# EAGLE schematic BSPD Schematic (EAGLE 8.4.0)
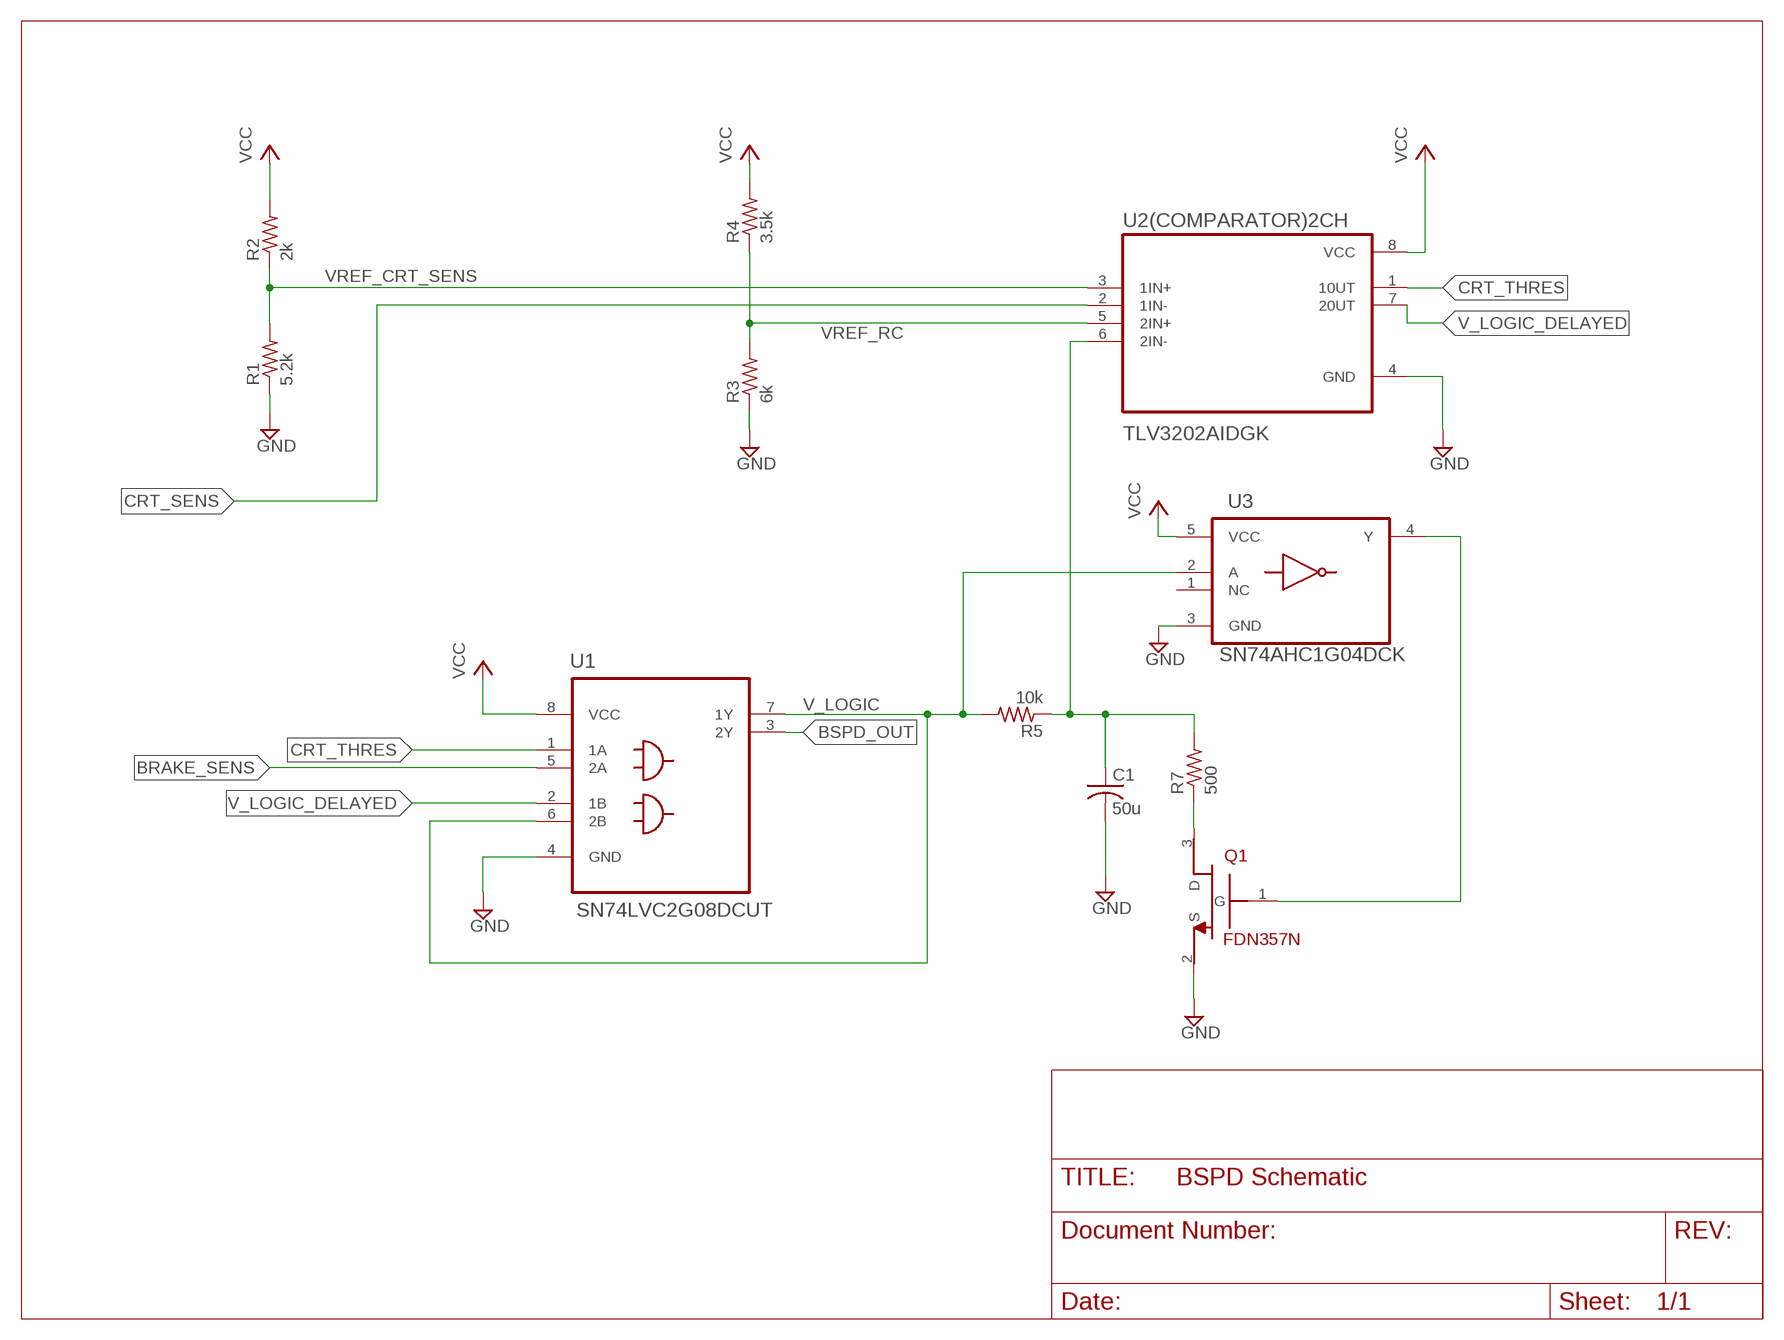
[diagram p0: schematic, sheet 1]

## Parts
C1  50u  C-USC0603  [C0603]
Q1  FDN357N  [SOT95P280X130-3N]
R1  5.2k  R-US_R0603  [R0603]
R2  2k  R-US_R0603  [R0603]
R3  6k  R-US_R0603  [R0603]
R4  3.5k  R-US_R0603  [R0603]
R5  10k  R-US_R0603  [R0603]
R7  500  R-US_R0603  [R0603]
U1  SN74LVC2G08DCUT  [SOP50P310X90-8N]
U2(COMPARATOR)2CH  TLV3202AIDGK  [SOP65P490X110-9N]
U3  SN74AHC1G04DCK  [SOT65P210X110-5N]

## Nets
BRAKE_SENS: U1.5(2A)
BSPD_OUT: U1.3(2Y)
CRT_SENS: U2(COMPARATOR)2CH.2(1IN-)
CRT_THRES: U1.1(1A) U2(COMPARATOR)2CH.1(10UT)
GND: C1.2 Q1.2(S) R1.1 R3.1 U1.4(GND) U2(COMPARATOR)2CH.4(GND) U3.3(GND)
N$1: C1.1 R5.1 R7.2 U2(COMPARATOR)2CH.6(2IN-)
N$2: Q1.3(D) R7.1
N$3: Q1.1(G) U3.4(Y)
V_LOGIC: R5.2 U1.6(2B) U1.7(1Y) U3.2(A)
V_LOGIC_DELAYED: U1.2(1B) U2(COMPARATOR)2CH.7(20UT)
VCC: R2.2 R4.2 U1.8(VCC) U2(COMPARATOR)2CH.8(VCC) U3.5(VCC)
VREF_CRT_SENS: R1.2 R2.1 U2(COMPARATOR)2CH.3(1IN+)
VREF_RC: R3.2 R4.1 U2(COMPARATOR)2CH.5(2IN+)
Unconnected: U3.1(NC)

## Library data of the parts
C1 = resistor:C-US: CAPACITOR, American symbol
Q1 = SOT95P280X130-3N:FDN357N: N-Channel MOSFET, 1.9 A, 30 V, Rds = 0.09 Ohms
R1-R5 R7 = resistor:R-US_: RESISTOR, American symbol
U1 = SN74LVC2G08DCUT:SN74LVC2G08DCUT: DUAL 2-INPUT POSITIVE-AND GATE; AVAILABILITY: Good; DESCRIPTION: IC GATE AND 2CH 2-INP US8; MF: Texas Instruments; MP: SN74LVC2G08DCUT; PACKAGE: VFSOP-8 Texas Instruments; PRICE: 0.50 USD
U2(COMPARATOR)2CH = TLV3202AIDGK:TLV3202AIDGK: None; AVAILABILITY: Good; DESCRIPTION: IC COMPAR PWR RRI DL PP 8VSSOP; MF: Texas Instruments; MP: TLV3202AIDGK; PACKAGE: MSOP-8 Texas Instruments; PRICE: 1.25 USD
U3 = SN74AHC1G04DCK:SN74AHC1G04DCK: SINGLE INVERTER GATE; AVAILABILITY: Unavailable; DESCRIPTION: Single Inverter Gate 5-SC70 -40 to 125; MF: Texas Instruments; MP: SN74AHC1G04DCK; PACKAGE: SC-70-5 Texas Instruments; PRICE: None